# EAGLE design cameo (EAGLE 9.6.2)
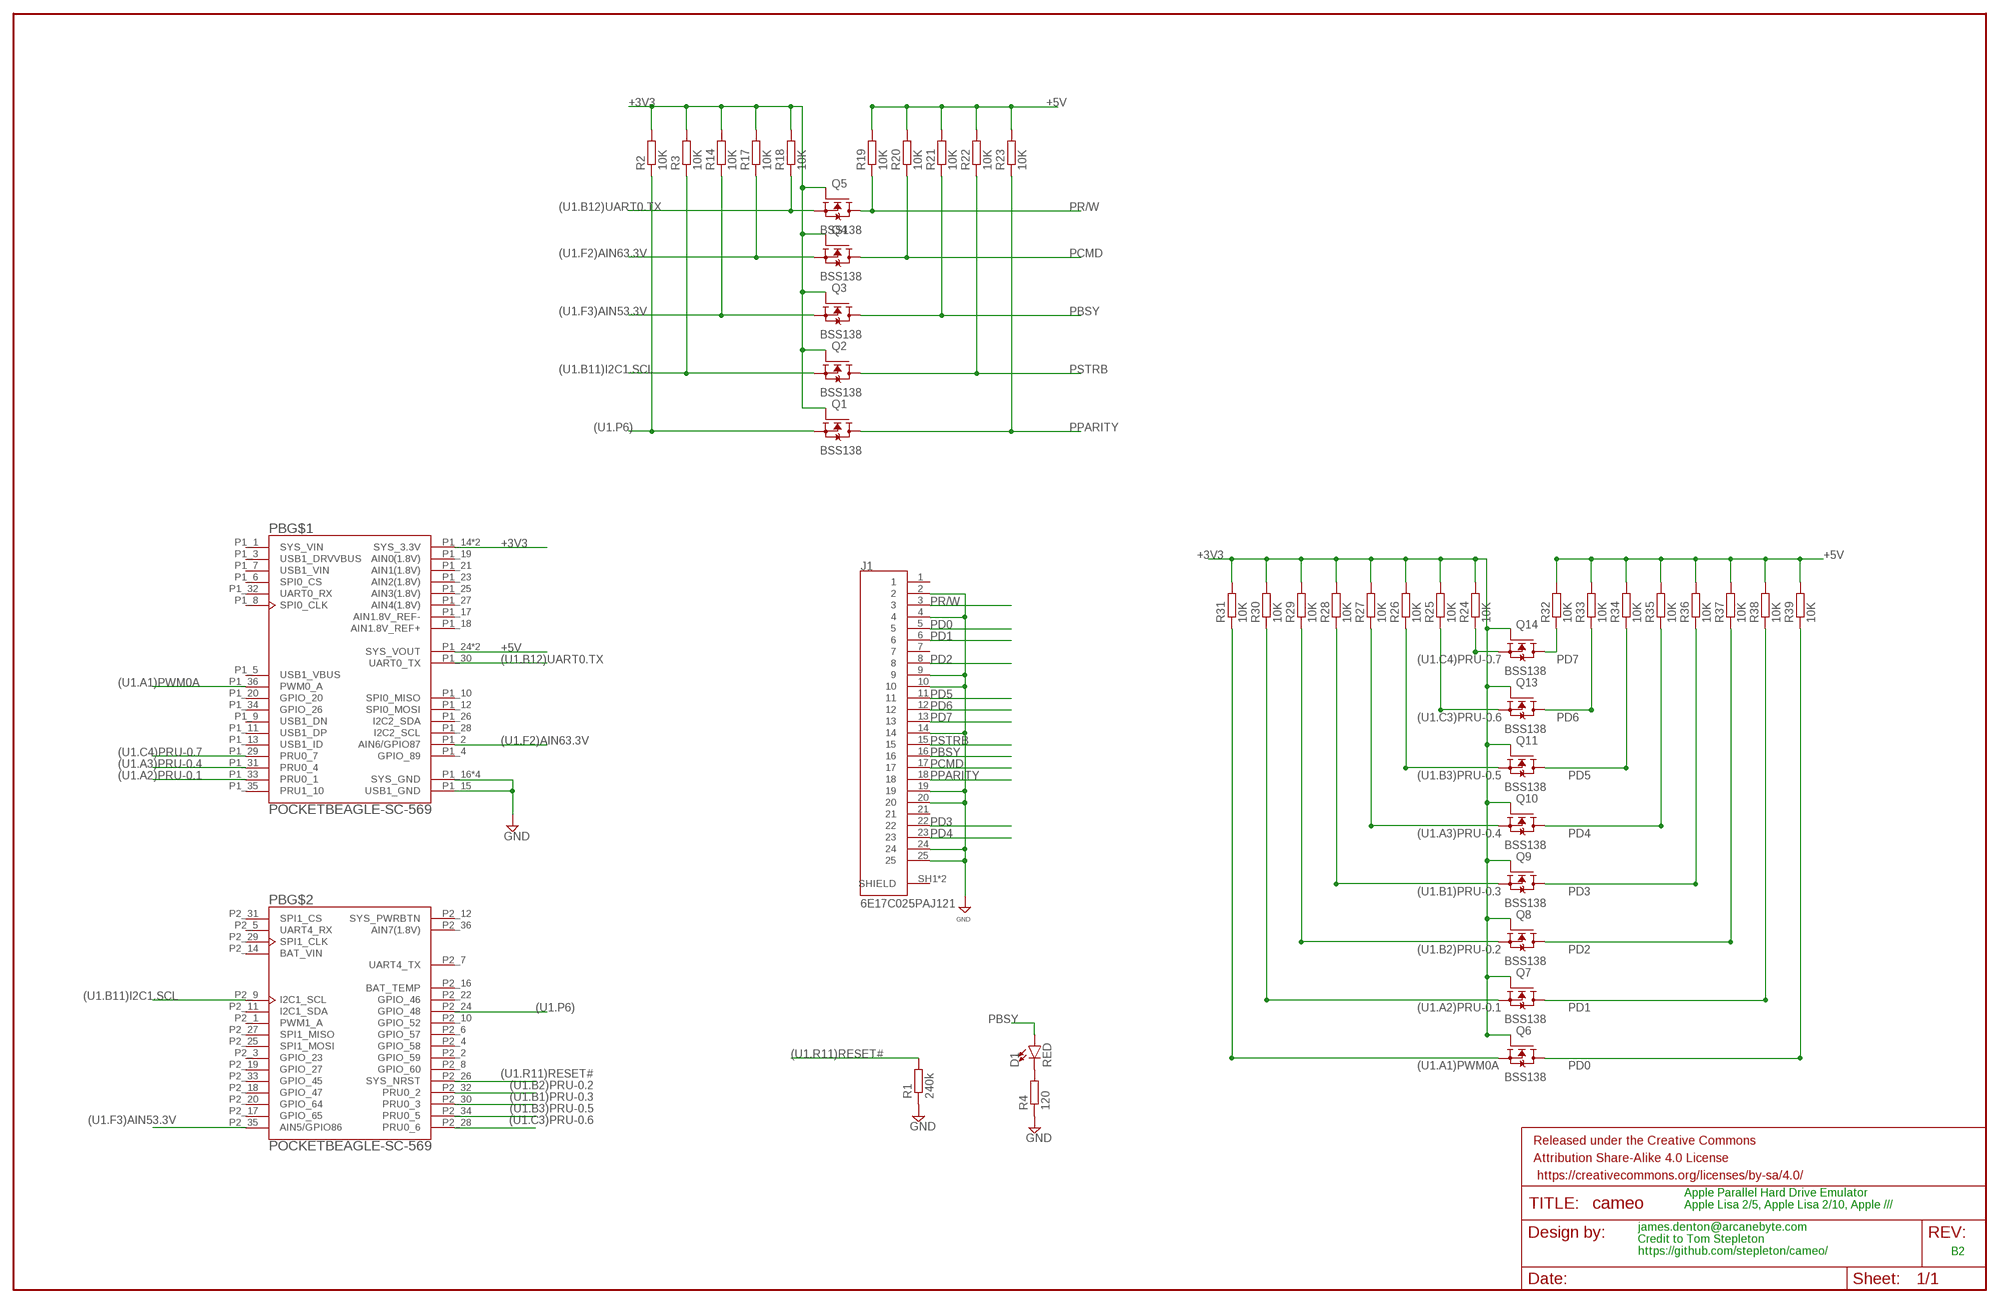
[diagram p0: schematic, sheet 1]

## Parts
D1  RED  LED-RED0603  [LED-0603]
FRAME1  FRAME-LEDGER  [CREATIVE_COMMONS]
J1  6E17C025PAJ121  [CONN_6E17C025PAJ121]
PB  POCKETBEAGLE-SC-569  [BEAGLE_POCKETBEAGLE-SC-569]
Q1  BSS138  [SOT95P240X111-3N]
Q2  BSS138  [SOT95P240X111-3N]
Q3  BSS138  [SOT95P240X111-3N]
Q4  BSS138  [SOT95P240X111-3N]
Q5  BSS138  [SOT95P240X111-3N]
Q6  BSS138  [SOT95P240X111-3N]
Q7  BSS138  [SOT95P240X111-3N]
Q8  BSS138  [SOT95P240X111-3N]
Q9  BSS138  [SOT95P240X111-3N]
Q10  BSS138  [SOT95P240X111-3N]
Q11  BSS138  [SOT95P240X111-3N]
Q13  BSS138  [SOT95P240X111-3N]
Q14  BSS138  [SOT95P240X111-3N]
R1  240k  R-EU_R0603  [R0603]
R2  10K  R-EU_R0603  [R0603]
R3  10K  R-EU_R0603  [R0603]
R4  120  R-EU_R0603  [R0603]
R14  10K  R-EU_R0603  [R0603]
R17  10K  R-EU_R0603  [R0603]
R18  10K  R-EU_R0603  [R0603]
R19  10K  R-EU_R0603  [R0603]
R20  10K  R-EU_R0603  [R0603]
R21  10K  R-EU_R0603  [R0603]
R22  10K  R-EU_R0603  [R0603]
R23  10K  R-EU_R0603  [R0603]
R24  10K  R-EU_R0603  [R0603]
R25  10K  R-EU_R0603  [R0603]
R26  10K  R-EU_R0603  [R0603]
R27  10K  R-EU_R0603  [R0603]
R28  10K  R-EU_R0603  [R0603]
R29  10K  R-EU_R0603  [R0603]
R30  10K  R-EU_R0603  [R0603]
R31  10K  R-EU_R0603  [R0603]
R32  10K  R-EU_R0603  [R0603]
R33  10K  R-EU_R0603  [R0603]
R34  10K  R-EU_R0603  [R0603]
R35  10K  R-EU_R0603  [R0603]
R36  10K  R-EU_R0603  [R0603]
R37  10K  R-EU_R0603  [R0603]
R38  10K  R-EU_R0603  [R0603]
R39  10K  R-EU_R0603  [R0603]

## Nets
(U1.A1)PWM0A: PB.P1_36(PWM0_A) Q6.2(S) R31.1
(U1.A2)PRU-0.1: PB.P1_33(PRU0_1) Q7.2(S) R30.1
(U1.A3)PRU-0.4: PB.P1_31(PRU0_4) Q10.2(S) R27.1
(U1.B1)PRU-0.3: PB.P2_30(PRU0_3) Q9.2(S) R28.1
(U1.B2)PRU-0.2: PB.P2_32(PRU0_2) Q8.2(S) R29.1
(U1.B3)PRU-0.5: PB.P2_34(PRU0_5) Q11.2(S) R26.1
(U1.B11)I2C1.SCL: PB.P2_9(I2C1_SCL) Q2.2(S) R3.1
(U1.B12)UART0.TX: PB.P1_30(UART0_TX) Q5.2(S) R18.1
(U1.C3)PRU-0.6: PB.P2_28(PRU0_6) Q13.2(S) R25.1
(U1.C4)PRU-0.7: PB.P1_29(PRU0_7) Q14.2(S) R24.1
(U1.F2)AIN63.3V: PB.P1_2(AIN6/GPIO87) Q4.2(S) R17.1
(U1.F3)AIN53.3V: PB.P2_35(AIN5/GPIO86) Q3.2(S) R14.1
(U1.P6): PB.P2_24(GPIO_48) Q1.2(S) R2.1
(U1.R11)RESET#: PB.P2_26(SYS_NRST) R1.2
+3V3: PB.P1_14(SYS_3.3V) PB.P2_23(SYS_3.3V) Q1.1(G) Q2.1(G) Q3.1(G) Q4.1(G) Q5.1(G) Q6.1(G) Q7.1(G) Q8.1(G) Q9.1(G) Q10.1(G) Q11.1(G) Q13.1(G) Q14.1(G) R2.2 R3.2 R14.2 R17.2 R18.2 R24.2 R25.2 R26.2 R27.2 R28.2 R29.2 R30.2 R31.2
+5V: PB.P1_24(SYS_VOUT) PB.P2_13(SYS_VOUT) R19.2 R20.2 R21.2 R22.2 R23.2 R32.2 R33.2 R34.2 R35.2 R36.2 R37.2 R38.2 R39.2
GND: J1.2 J1.4 J1.9 J1.10 J1.14 J1.19 J1.20 J1.24 J1.25 PB.P1_15(USB1_GND) PB.P1_16(SYS_GND) PB.P1_22(SYS_GND) PB.P2_15(SYS_GND) PB.P2_21(SYS_GND) R1.1 R4.1
N$1: D1.C R4.2
PBSY: D1.A J1.16 Q3.3(D) R21.1
PCMD: J1.17 Q4.3(D) R20.1
PD0: J1.5 Q6.3(D) R39.1
PD1: J1.6 Q7.3(D) R38.1
PD2: J1.8 Q8.3(D) R37.1
PD3: J1.22 Q9.3(D) R36.1
PD4: J1.23 Q10.3(D) R35.1
PD5: J1.11 Q11.3(D) R34.1
PD6: J1.12 Q13.3(D) R33.1
PD7: J1.13 Q14.3(D) R32.1
PPARITY: J1.18 Q1.3(D) R23.1
PR/W: J1.3 Q5.3(D) R19.1
PSTRB: J1.15 Q2.3(D) R22.1
Unconnected: J1.1 J1.7 J1.21 J1.SH1(SHIELD) J1.SH2(SHIELD) PB.P1_1(SYS_VIN) PB.P1_3(USB1_DRVVBUS) PB.P1_4(GPIO_89) PB.P1_5(USB1_VBUS) PB.P1_6(SPI0_CS) PB.P1_7(USB1_VIN) PB.P1_8(SPI0_CLK) PB.P1_9(USB1_DN) PB.P1_10(SPI0_MISO) PB.P1_11(USB1_DP) PB.P1_12(SPI0_MOSI) PB.P1_13(USB1_ID) PB.P1_20(GPIO_20) PB.P1_26(I2C2_SDA) PB.P1_28(I2C2_SCL) PB.P1_32(UART0_RX) PB.P1_34(GPIO_26) PB.P1_35(PRU1_10) PB.P2_1(PWM1_A) PB.P2_2(GPIO_59) PB.P2_3(GPIO_23) PB.P2_4(GPIO_58) PB.P2_5(UART4_RX) PB.P2_6(GPIO_57) PB.P2_7(UART4_TX) PB.P2_8(GPIO_60) PB.P2_10(GPIO_52) PB.P2_11(I2C1_SDA) PB.P2_14(BAT_VIN) PB.P2_16(BAT_TEMP) PB.P2_17(GPIO_65) PB.P2_18(GPIO_47) PB.P2_19(GPIO_27) PB.P2_20(GPIO_64) PB.P2_22(GPIO_46) PB.P2_25(SPI1_MOSI) PB.P2_27(SPI1_MISO) PB.P2_29(SPI1_CLK) PB.P2_31(SPI1_CS) PB.P2_33(GPIO_45)

## Notes on the sheet
- Apple Parallel Hard Drive Emulator
  Apple Lisa 2/5, Apple Lisa 2/10, Apple ///
- james.denton@arcanebyte.com
  Credit to Tom Stepleton
  https://github.com/stepleton/cameo/
- B2

## Power pins joined to a net without a drawn wire
AIN0(1.8V): PB.P1_19(AIN0(1.8V))
AIN1(1.8V): PB.P1_21(AIN1(1.8V))
AIN1.8V_REF+: PB.P1_18(AIN1.8V_REF+)
AIN1.8V_REF-: PB.P1_17(AIN1.8V_REF-)
AIN2(1.8V): PB.P1_23(AIN2(1.8V))
AIN3(1.8V): PB.P1_25(AIN3(1.8V))
AIN4(1.8V): PB.P1_27(AIN4(1.8V))
AIN7(1.8V): PB.P2_36(AIN7(1.8V))
SYS_PWRBTN: PB.P2_12(SYS_PWRBTN)

## Library data of the parts
D1 = sparkfun-led:LED-RED: Red SMD LED Used in manufacturing of most products at SparkFun Packages: 0603 - SMD 0603 package [Product Link] <http://docs.avagotech.com/docs/AV02-0551EN> 0603 SMART - SMD 0603 SMART package ( more efficient and expensive)[Product Link] <http://www.osram-os.com/Graphics/XPic2/00077099_0.pdf> 1206 - SMD1206 package [Product Link] <https://www.sparkfun.com/datasheets/DevTools/LilyPad/Q150OVS4.pdff> SparkFun Products: Pro Mini 328 -5V <https://www.sparkfun.com/products/821> RedBoard <https://www.sparkfun.com/products/12757> IOIO-OTG <https://www.sparkfun.com/products/13613>; PROD_ID: DIO-00819
FRAME1 = SparkFun-Aesthetics:FRAME-LEDGER: Schematic Frame - Ledger Standard 11x14 US Ledger frame
J1 = 6E17C025PAJ121:6E17C025PAJ121: Conn D-Subminiature PIN 25 POS 2.76mm Solder RA Thru-Hole 25 Terminal 1 Port; DESCRIPTION: Conn D-Subminiature PIN 25 POS 2.76mm Solder RA Thru-Hole 25 Terminal 1 Port; MF: Amphenol; MP: 6E17C025PAJ121; PACKAGE: None
PB = POCKETBEAGLE-SC-569:POCKETBEAGLE-SC-569: DEV BOARD POCKETBEAGLE Check prices <https://pricing.snapeda.com/parts/POCKETBEAGLE-SC-569/GHI%20Electronics%2C/view-part?ref=eda>; AVAILABILITY: Warning; DESCRIPTION: OSD3358 PocketBeagle - ARM® Cortex®-A8 MPU Embedded Evaluation Board; MF: GHI Electronics,; MP: POCKETBEAGLE-SC-569; PACKAGE: None; PRICE: None; PURCHASE-URL: https://pricing.snapeda.com/search/part/POCKETBEAGLE-SC-569/?ref=eda
Q1-Q11 Q13 Q14 = BSS138:BSS138: N-Channel 50V 220mA (Ta) 360mW (Ta) Surface Mount SOT-23-3 Check prices <https://pricing.snapeda.com/parts/BSS138/ON%20Semiconductor/view-part?ref=eda>; AVAILABILITY: In Stock; DESCRIPTION: N-Channel 50V 200mA (Ta) 225mW (Ta) Surface Mount SOT-23-3 (TO-236); MF: ON Semiconductor; MP: BSS138; PACKAGE: SOT-23 ON; PRICE: None
R1-R4 R14 R17-R39 = rcl:R-EU_: RESISTOR, European symbol; SPICEPREFIX: R

## Board
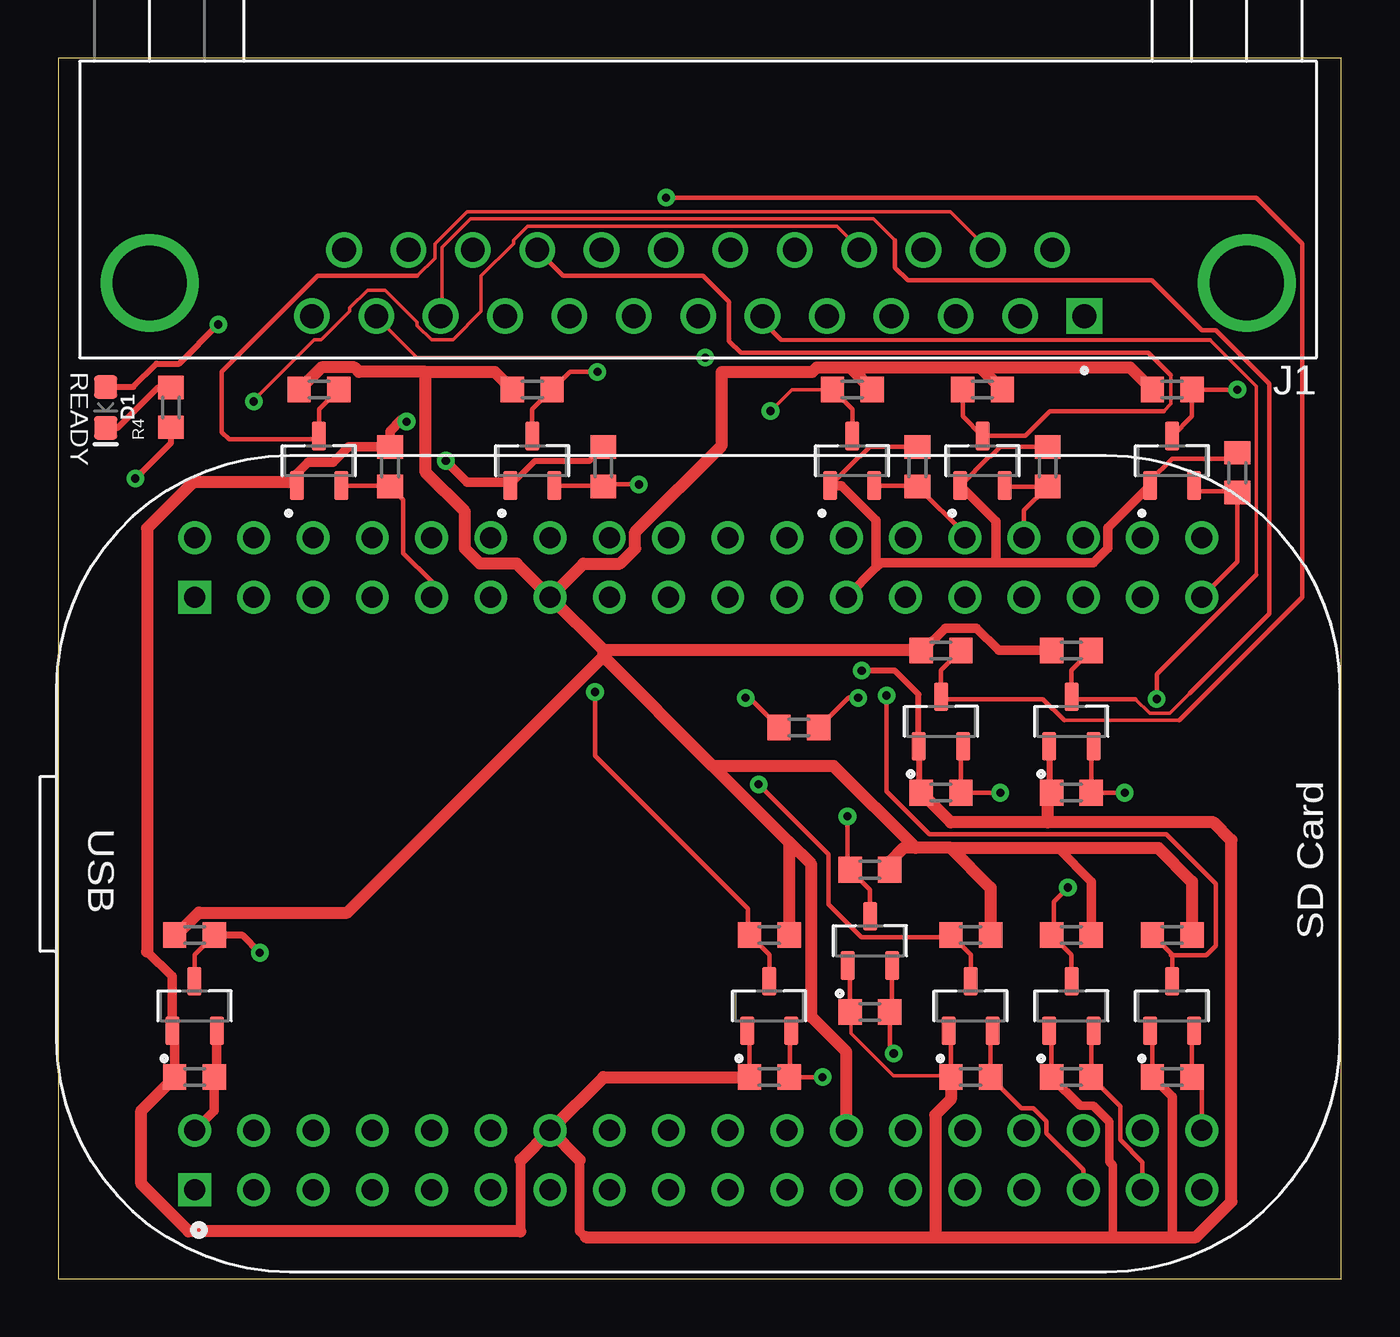
[diagram p1: board, top side]
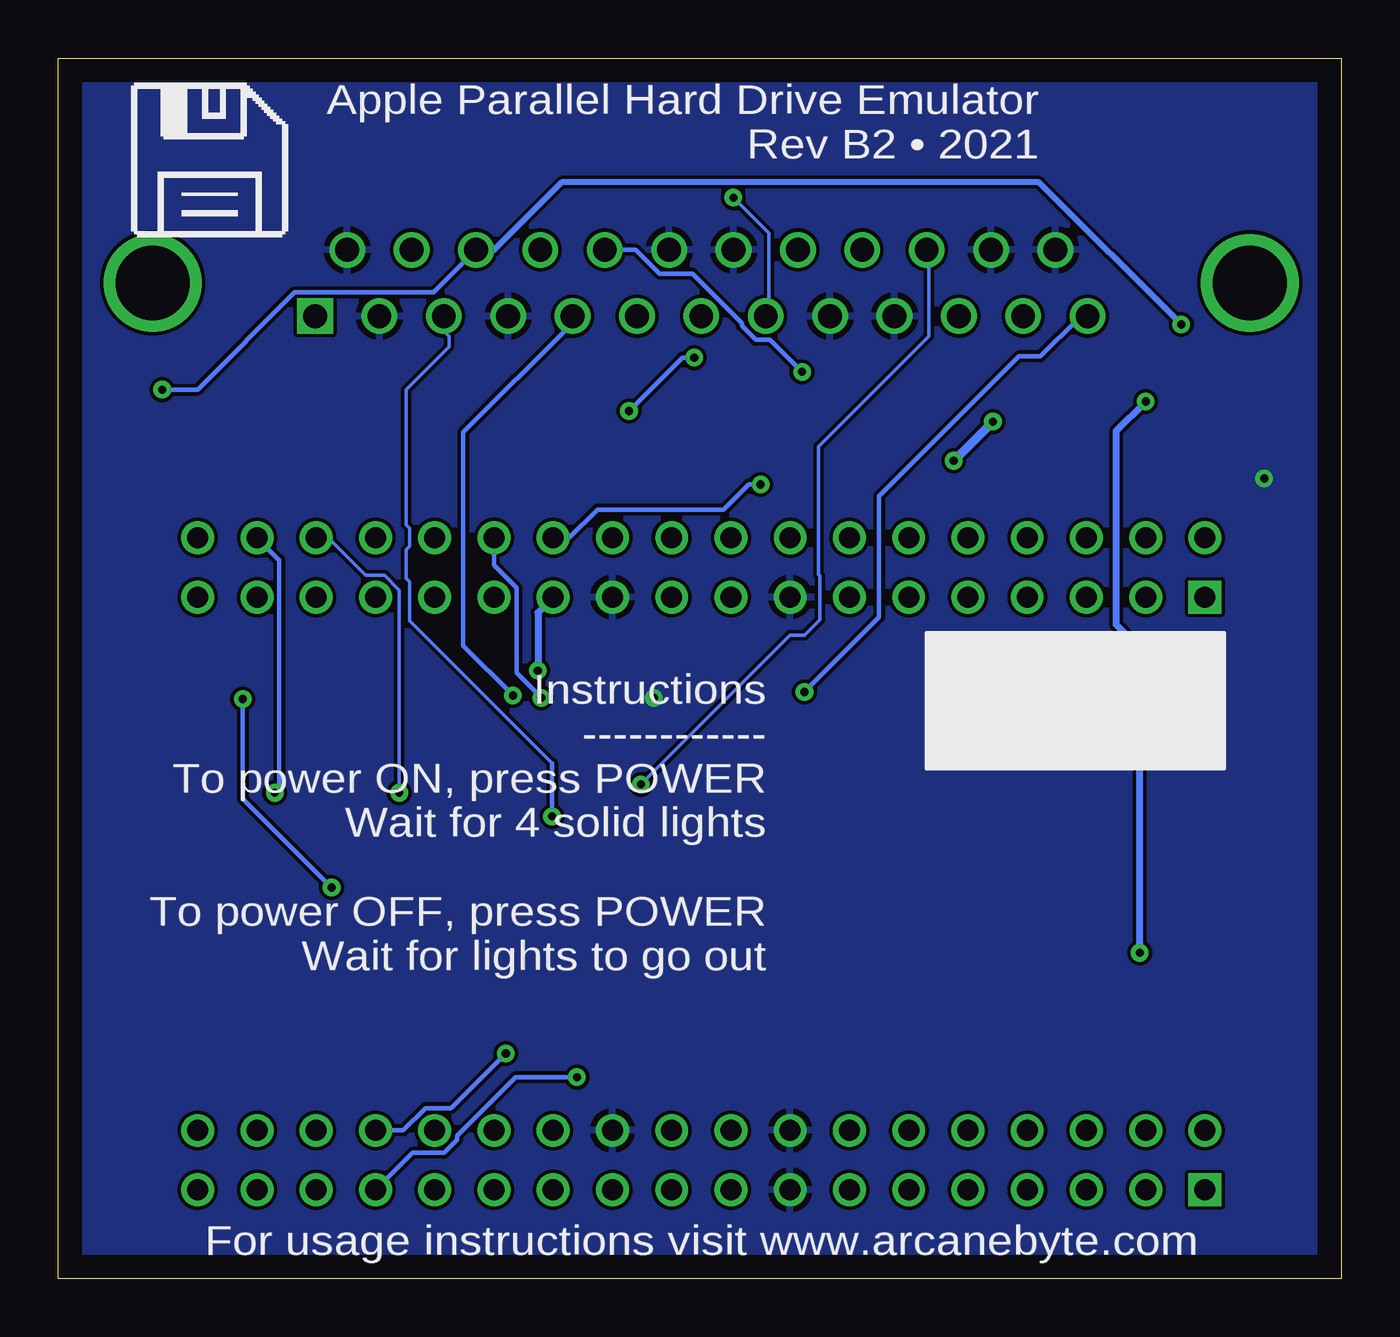
[diagram p2: board, bottom side, seen from below]

Size 55 x 52.3 mm. Coordinates in mm from the lower left corner, seen from the top.
Outline: 0,0 55,0 55,52.3 0,52.3 0,0
Copper layers (1*16): Top 0.035mm / dielectric 1.5mm / Bottom 0.035mm
Design rules "default": minimum track width 6mil, minimum drill 0.35mm, track to track 6mil, track to pad 6mil, pad to pad 6mil, via to via 6mil, smd to smd 6mil, copper to edge 40mil, drill to drill 6mil, minimum pad ring 10mil, minimum via ring 8mil, stop-mask expansion 4mil, vias tented up to drill 0mil, thermal gap 10mil

### Footprints (pad centres in the part's own frame; a part is rotated, then mirrored left to right if it is on the bottom)
LED-0603 = smd 1 x 1: A -0.877,0; C 0.877,0
CONN_6E17C025PAJ121 = drill 1.02 square: 1 -16.56,1.42 | drill 1.02: 2 -13.8,1.42; 3 -11.04,1.42; 4 -8.28,1.42; 5 -5.52,1.42; 6 -2.76,1.42; 7 0,1.42; 8 2.76,1.42; 9 5.52,1.42; 10 8.28,1.42; 11 11.04,1.42; 12 13.8,1.42; 13 16.56,1.42; 14 -15.18,-1.42; 15 -12.42,-1.42; 16 -9.66,-1.42; 17 -6.9,-1.42; 18 -4.14,-1.42; 19 -1.38,-1.42; 20 1.38,-1.42; 21 4.14,-1.42; 22 6.9,-1.42; 23 9.66,-1.42; 24 12.42,-1.42; 25 15.18,-1.42 | drill 3.18: SH1 -23.52,0; SH2 23.52,0
BEAGLE_POCKETBEAGLE-SC-569 = drill 0.9 square: P1_1 -13.97,21.59; P2_1 11.43,21.59 | drill 0.9: P1_2 -11.43,21.59; P1_3 -13.97,19.05; P1_4 -11.43,19.05; P1_5 -13.97,16.51; P1_6 -11.43,16.51; P1_7 -13.97,13.97; P1_8 -11.43,13.97; P1_9 -13.97,11.43; P1_10 -11.43,11.43; P1_11 -13.97,8.89; P1_12 -11.43,8.89; P1_13 -13.97,6.35; P1_14 -11.43,6.35; P1_15 -13.97,3.81; P1_16 -11.43,3.81; P1_17 -13.97,1.27; P1_18 -11.43,1.27; P1_19 -13.97,-1.27; P1_20 -11.43,-1.27; P1_21 -13.97,-3.81; P1_22 -11.43,-3.81; P1_23 -13.97,-6.35; P1_24 -11.43,-6.35; P1_25 -13.97,-8.89; P1_26 -11.43,-8.89; P1_27 -13.97,-11.43; P1_28 -11.43,-11.43; P1_29 -13.97,-13.97; P1_30 -11.43,-13.97; P1_31 -13.97,-16.51; P1_32 -11.43,-16.51; P1_33 -13.97,-19.05; P1_34 -11.43,-19.05; P1_35 -13.97,-21.59; P1_36 -11.43,-21.59; P2_2 13.97,21.59; P2_3 11.43,19.05; P2_4 13.97,19.05; P2_5 11.43,16.51; P2_6 13.97,16.51; P2_7 11.43,13.97; P2_8 13.97,13.97; P2_9 11.43,11.43; P2_10 13.97,11.43; P2_11 11.43,8.89; P2_12 13.97,8.89; P2_13 11.43,6.35; P2_14 13.97,6.35; P2_15 11.43,3.81; P2_16 13.97,3.81; P2_17 11.43,1.27; P2_18 13.97,1.27; P2_19 11.43,-1.27; P2_20 13.97,-1.27; P2_21 11.43,-3.81; P2_22 13.97,-3.81; P2_23 11.43,-6.35; P2_24 13.97,-6.35; P2_25 11.43,-8.89; P2_26 13.97,-8.89; P2_27 11.43,-11.43; P2_28 13.97,-11.43; P2_29 11.43,-13.97; P2_30 13.97,-13.97; P2_31 11.43,-16.51; P2_32 13.97,-16.51; P2_33 11.43,-19.05; P2_34 13.97,-19.05; P2_35 11.43,-21.59; P2_36 13.97,-21.59
SOT95P240X111-3N = smd 1.23 x 0.6: 1 -1.06,0.95; 2 -1.06,-0.95; 3 1.06,0
R0603 = smd 1 x 1.1: 1 -0.85,0; 2 0.85,0

### Placement (x,y rotation side)
D1  2.03,37.34 270 top
FRAME1  20.07,-7.87 0 top  (outside the outline)
J1  27.43,42.67 180 top
PB  27.43,17.78 90 top
Q1  20.32,35.05 90 top
Q2  11.18,35.05 90 top
Q3  47.75,35.05 90 top
Q4  5.84,11.68 90 top
Q5  34.8,14.48 90 top
Q6  47.75,11.68 90 top
Q7  43.43,11.68 90 top
Q8  37.85,23.88 90 top
Q9  39.62,35.05 90 top
Q10  39.12,11.68 90 top
Q11  43.43,23.88 90 top
Q13  34.04,35.05 90 top
Q14  30.48,11.68 90 top
R1  31.75,23.62 0 top
R2  23.37,34.8 90 top
R3  14.22,34.8 90 top
R4  4.83,37.34 90 top
R14  50.55,34.54 90 top
R17  5.84,8.64 180 top
R18  34.8,11.43 180 top
R19  34.8,17.53 0 top
R20  5.84,14.73 180 top
R21  47.75,38.1 180 top
R22  11.18,38.1 180 top
R23  20.32,38.1 180 top
R24  30.48,8.64 180 top
R25  36.83,34.8 90 top
R26  43.43,20.83 180 top
R27  39.12,8.64 180 top
R28  42.42,34.8 90 top
R29  37.85,20.83 180 top
R30  43.43,8.64 180 top
R31  47.75,8.64 180 top
R32  30.48,14.73 0 top
R33  34.04,38.1 0 top
R34  43.43,26.92 180 top
R35  39.12,14.73 0 top
R36  39.62,38.1 0 top
R37  37.85,26.92 180 top
R38  43.43,14.73 0 top
R39  47.75,14.73 0 top

### Tracks (layer width: path | path; a pad name or v marks a point on that pad's centre or on a via)
(U1.A1)PWM0A
  Top 0.203: PB.P1_36 49.02,8.22 R31.1 48.6,10.52 Q6.2
(U1.A2)PRU-0.1
  Top 0.203: PB.P1_33 46.48,5 45.52,5.95 45.52,7.4 R30.1 44.28,10.52 Q7.2
(U1.A3)PRU-0.4
  Top 0.203: PB.P1_31 43.94,4.66 42.36,6.24 42.36,6.75 41.8,7.31 41.29,7.31 R27.1 39.97,10.52 Q10.2
(U1.B1)PRU-0.3
  Top 0.203: PB.P2_30 41.4,32.93 R28.1 40.62,33.95 Q9.2
(U1.B2)PRU-0.2  (via drill 0.35)
  Top 0.203: Q8.2 38.7,22.72 R29.1 v40.39,20.83
  Bottom 0.152: PB.P2_32 43.43,31.75 41.83,30.14 41.02,30.14 40.39,29.51 v40.39,20.83
(U1.B3)PRU-0.5  (via drill 0.35)
  Top 0.203: Q11.2 44.28,22.72 R26.1 v45.72,20.83
  Bottom 0.203: v45.72,20.83 45.52,21.02 45.52,30.79 PB.P2_34
(U1.B11)I2C1.SCL
  Top 0.203: Q2.2 14.18,33.99 R3.1 14.79,33.38 14.79,31.1 16,29.89 PB.P2_9
(U1.B12)UART0.TX  (via drill 0.35)
  Top 0.203: v35.81,9.65 35.65,9.82 R18.1 35.75,11.53 Q5.2
  Bottom 0.203: v35.81,9.65 38.16,7.31 39.26,7.31 40.22,6.35 PB.P1_30
(U1.C3)PRU-0.6
  Top 0.203: Q13.2 36.79,33.99 R25.1 38.86,31.92 PB.P2_28
(U1.C4)PRU-0.7  (via drill 0.35)
  Top 0.203: Q14.2 31.36,10.55 31.36,8.66 R24.1 v32.77,8.64
  Bottom 0.203: PB.P1_29 39.82,5.39 38.47,5.39 37.9,5.95 37.9,6.12 35.39,8.64 v32.77,8.64
(U1.F2)AIN63.3V
  Top 0.203: 6.79,8.74 R17.1
  Top 0.406: Q4.2 6.79,8.74 | R17.1 6.69,7.2 PB.P1_2
(U1.F3)AIN53.3V
  Top 0.203: Q3.2 48.96,33.74 50.5,33.74 R14.1 50.55,30.73 PB.P2_35
(U1.P6)  (via drill 0.35)
  Top 0.203: v24.89,34.04 23.46,34.04 R2.1 23.32,33.99 Q1.2
  Bottom 0.203: v24.89,34.04 25.4,34.04 26.47,32.96 31.89,32.96 33.1,31.75 PB.P2_24
(U1.R11)RESET#  (via drill 0.35)
  Top 0.203: R1.2 33.87,24.89 v34.29,24.89
  Bottom 0.203: PB.P2_26 36.32,30.57 35.36,29.61 35.36,25.97 v34.29,24.89
+3V3  (via drill 0.35)
  Top 0.152: R18.2 33.98,11.43 33.98,10.52 35.81,8.69 38.1,8.69 R27.2 | 4.88,10.67 Q4.1 | 10.21,34.14 Q2.1 | 19.36,34.14 Q1.1 | 36.88,22.86 Q8.1
  Top 0.203: R27.2 38.27,10.52 Q10.1 | Q14.1 29.63,10.52 R24.2 | R30.2 42.58,10.52 Q7.1 | R31.2 46.9,10.52 Q6.1 | 4.99,10.52 Q4.1 | R18.2 33.95,13.32 Q5.1 | Q3.1 46.8,34.19 47.76,35.14 50.29,35.14 R14.2 | Q9.1 39.92,35.24 39.98,35.24 40.39,35.65 R28.2 | Q13.1 34.34,35.24 34.4,35.24 34.8,35.65 R25.2 | Q2.1 10.23,34.5 | 36.9,20.93 R29.2 | 42.48,20.93 R26.2
  Top 0.254: Q8.1 36.9,20.93 | Q11.1 42.48,20.93 | 14.88,36.78 v14.94,36.73 | v34.44,26.06 35.87,26.06 36.88,25.04 36.88,22.86 | Q1.1 20.43,35.05 22.77,35.05 R2.2
  Top 0.305: 37.6,1.78 37.59,1.78
  Top 0.356: R30.2 43.81,7.41 44.38,7.41 45.07,6.72 45.07,5 45.21,4.86 45.21,1.78
  Top 0.406: R17.2 4.99,10.52 | 10.23,34.5 10.71,34.99 11.79,34.99 12.45,35.65 R3.2 14.22,36.32 14.68,36.78 14.88,36.78 | 19.81,5.08 19.81,2.03 | 22.35,5.08 22.35,2.03 22.61,1.78 | R31.2 47.75,7.79 47.75,1.78 | 42.42,20.66 R26.2 | PB.P2_23 35.05,30.48 | 35.05,30.48 35.05,32.51 33.57,33.99 Q13.1 | 35.05,30.48 35.26,30.69 40.13,30.69 | Q9.1 40.2,32.47 40.2,30.76 40.13,30.69 | Q3.1 45,32.19 45,31.31 44.38,30.69 40.13,30.69 | 4.88,10.67 4.88,12.95 3.81,14.02 | 19.36,34.14 17.53,34.14 v16.61,35.05
  Top 0.508: PB.P1_14 19.81,5.08 | R17.2 3.56,7.2 3.56,4.06 5.59,2.03 19.81,2.03 | PB.P1_14 22.35,5.08 | 22.61,1.78 37.59,1.78 45.21,1.78 47.75,1.78 48.77,1.78 50.29,3.3 50.29,18.8 49.53,19.56 42.42,19.56 | PB.P1_14 23.37,8.64 R24.2 | 42.42,19.56 42.42,20.66 | 42.42,19.56 38.27,19.56 R29.2 | 3.81,14.02 3.81,32.16 5.79,34.14 10.21,34.14 | R27.2 38.27,7.69 37.6,7.02 37.6,1.78
  Bottom 0.305: PB.P2_23 34.44,28.55 v34.44,26.06
  Bottom 0.406: v14.94,36.73 v16.61,35.05
+5V
  Top 0.406: R38.2 44.28,17.02 42.84,18.46 | R34.2 40.32,26.92 39.36,27.88 38.03,27.88 37.07,26.92 | 35.65,17.87 R19.2
  Top 0.508: 31.33,18.71 32.28,17.76 32.28,11.22 33.78,9.72 PB.P1_24 | 31.33,18.71 R32.2 | R35.2 39.97,16.76 38.27,18.46 | 38.27,18.46 36.75,18.46 | 36.75,18.46 36.24,18.46 35.65,17.87 | 38.27,18.46 42.84,18.46 47.16,18.46 48.6,17.02 R39.2 | 15.75,38.86 15.75,34.54 17.43,32.86 17.43,31.29 18.08,30.64 19.65,30.64 PB.P2_13 | 15.75,38.86 12.89,38.86 12.69,39.06 11.28,39.06 R22.2 | 15.75,38.86 18.71,38.86 R23.2 | PB.P2_13 22.51,30.64 24.08,30.64 24.73,31.29 24.73,32.01 28.45,35.72 28.45,38.86 32.32,38.86 32.52,39.06 33.93,39.06 | 33.93,39.06 R33.2 | 33.93,39.06 39.52,39.06 | R36.2 39.52,39.06 | 39.52,39.06 45.95,39.06 R21.2 | 37.07,26.92 R37.2 23.37,26.92 | 23.37,26.92 PB.P2_13 | 23.37,26.67 23.37,26.92 | 28.07,21.97 23.37,26.67 | R20.2 5.07,14.73 6.02,15.69 12.39,15.69 23.37,26.67 | 31.33,18.71 28.07,21.97 | 28.07,21.97 33.23,21.97 36.75,18.46
GND  (via drill 0.35)
  Top 0.203: R1.1 29.63,24.89 v29.46,24.89
  Top 0.254: R4.1 4.83,35.81 v3.3,34.29
  pour Bottom: 0.51,51.82 54.61,51.82 54.61,1.02 54.36,0.76 0.51,0.76
N$1
  Top 0.254: D1.C 2.54,36.46 4.27,38.19 R4.2
PBSY  (via drill 0.35)
  Top 0.203: Q3.3 48.6,36.96 R21.1 v50.55,38.1
  Top 0.254: D1.A 3.21,38.22 4.22,39.22 5.18,39.22 v6.86,40.89
  Bottom 0.203: v50.55,38.1 49.03,38.1 44.86,42.27 38.91,42.27 J1.16
  Bottom 0.254: J1.16 36.32,44.09 33.42,46.99 12.95,46.99 v6.86,40.89
PCMD  (via drill 0.35)
  Top 0.152: v8.38,37.59 8.38,37.64 10.97,40.23 11.28,40.23 12.5,41.45 12.5,41.6 13.26,42.37 14.02,42.37 15.39,41 15.39,40.84 16,40.23 16.92,40.23 18.14,41.45 18.14,42.98 19.51,44.35 19.51,44.5 20.12,45.11 33.38,45.11 34.29,44.2 J1.17
  Top 0.203: Q4.3 5.84,13.88 R20.1
  Top 0.305: R20.1 7.87,14.73 v8.64,13.97
  Bottom 0.305: v8.64,13.97 8.64,27.02 9.64,28.03 9.64,36.33 v8.38,37.59
PD0  (via drill 0.35)
  Top 0.152: 47.7,13.87 47.73,13.9
  Top 0.203: Q6.3 47.75,13.88 47.73,13.9 R39.1 | 47.7,13.87 49.23,13.87 49.63,14.28 49.63,16.92 47.5,19.05 37.34,19.05 35.51,20.88 v35.51,24.99
  Bottom 0.203: v35.51,24.99 37.64,27.13 37.64,28.65 37.64,36.27 33.07,40.84 33.07,41.15 J1.5
PD1  (via drill 0.35)
  Top 0.152: 51.36,30.18 51.36,38.25 49.38,40.23 | 42.67,14.78 R38.1
  Top 0.178: 30.99,40.23 49.38,40.23
  Top 0.203: Q7.3 43.43,13.88 R38.1 | 42.67,14.78 42.67,16.15 v43.28,16.76 | v47.09,24.84 47.09,25.91 51.36,30.18 | J1.6 30.19,41.03 30.99,40.23
  Bottom 0.203: v43.28,16.76 47.09,20.57 v47.09,24.84
PD2  (via drill 0.35)
  Top 0.152: 48.06,23.93 43.13,23.93 | 37.95,24.84 Q8.3
  Top 0.203: Q8.3 37.85,26.07 R37.1 | 37.95,24.84 42.22,24.84 43.13,23.93 | 48.06,23.93 53.34,29.21 53.34,44.35 51.36,46.33 v26.06,46.33
  Bottom 0.152: v26.06,46.33 24.54,44.81 24.54,41.3 J1.8
PD3
  Top 0.152: 47.4,37.19 47.7,37.49 47.7,38.71 | Q9.3 | 20.57,44.04 J1.22
  Top 0.203: Q9.3 38.77,36.96 R36.1 | Q9.3 41.45,36.12 42.52,37.19 47.4,37.19 | 47.7,38.71 46.74,39.67 29.26,39.67 28.75,40.18 28.75,41.86 27.64,42.98 21.64,42.98 20.57,44.04
PD4  (via drill 0.35)
  Top 0.152: 38.25,14.63 R35.1
  Top 0.203: Q10.3 39.12,13.88 R35.1 | 38.25,14.63 34.44,14.63 33.02,16.05 33.02,18.19 v30.02,21.18
  Bottom 0.152: v30.02,21.18 23.62,27.58 23.01,27.58 22.35,28.25 22.35,30.12 22.4,30.18 22.4,35.66 17.68,40.39 17.68,43.84 17.73,43.89 17.73,44.05 J1.23
PD5
  Top 0.152: 46.18,24.84 46.79,24.23 47.65,24.23 48.51,25.09 | 35.87,44.5 34.95,45.41 17.68,45.41 16.46,44.2 16.46,41.3 J1.11 | 43.43,24.84 Q11.3
  Top 0.203: Q11.3 43.43,26.07 R34.1 | 46.18,24.84 43.43,24.84 | 35.87,44.5 35.87,43.33 36.42,42.78 46.88,42.78 49.02,40.64 49.63,40.64 51.92,38.35 51.92,28.5 48.51,25.09
PD6  (via drill 0.35)
  Top 0.152: R33.1 31.45,38.1 v30.53,37.19 | v27.74,39.47 15.39,39.47 13.72,41.15 J1.12
  Top 0.203: Q13.3 34.04,37.25 R33.1
  Bottom 0.203: v30.53,37.19 28.25,39.47 v27.74,39.47
PD7  (via drill 0.35)
  Top 0.152: 29.57,14.78 R32.1
  Top 0.203: Q14.3 30.48,13.88 R32.1 | 29.57,14.78 29.57,15.85 23.01,22.4 v23.01,25.15
  Bottom 0.152: 10.97,41.15 J1.13
  Bottom 0.203: v23.01,25.15 19.81,28.35 19.81,33.53 13.82,39.52 12.9,39.52 11.28,41.15 10.97,41.15
PPARITY  (via drill 0.35)
  Top 0.203: v23.11,38.86 21.93,38.86 R23.1 20.32,37.25 Q1.3
  Bottom 0.203: v23.11,38.86 24.48,40.23 25.09,40.23 25.69,40.83 25.69,40.95 27.81,43.07 29.23,43.07 30.25,44.09 J1.18
PR/W  (via drill 0.35)
  Top 0.152: 33.83,17.53 R19.1
  Top 0.203: Q5.3 34.8,16.68 R19.1 | v33.83,19.81 33.83,17.53
  Bottom 0.152: 33.83,22.1 39.93,28.19 39.93,29.87 40.08,30.02 40.08,31.24 39.93,31.39 39.93,32.16 40.08,32.31 40.08,38.1 38.25,39.93 38.25,40.39 38.41,40.54 38.41,41.15 J1.3
  Bottom 0.203: 33.83,22.1 v33.83,19.81
PSTRB
  Top 0.152: 15.39,42.98 16.15,43.74 16.15,44.35 17.53,45.72 38.25,45.72 39.78,44.2 J1.15 | 11.12,35.97 Q2.3
  Top 0.203: Q2.3 11.18,37.25 R22.1 | 11.12,35.97 7.32,35.97 7.01,36.27 7.01,38.86 11.12,42.98 15.39,42.98

### Text on the board
tPlace: READY | SD Card | USB
bPlace: Apple Parallel Hard Drive Emulator / Rev B2 • 2021 | Instructions / ------------ / To power ON, press POWER / Wait for 4 solid lights / / To power OFF, press POWER / Wait for lights to go out | For usage instructions visit www.arcanebyte.com